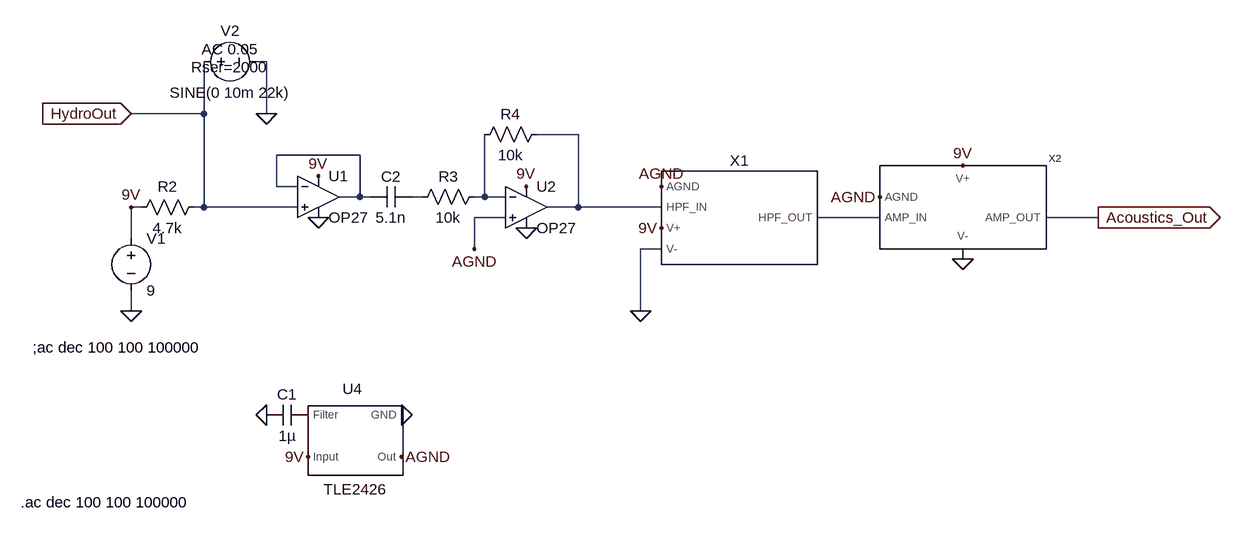
[diagram p0: schematic Combined.asc]
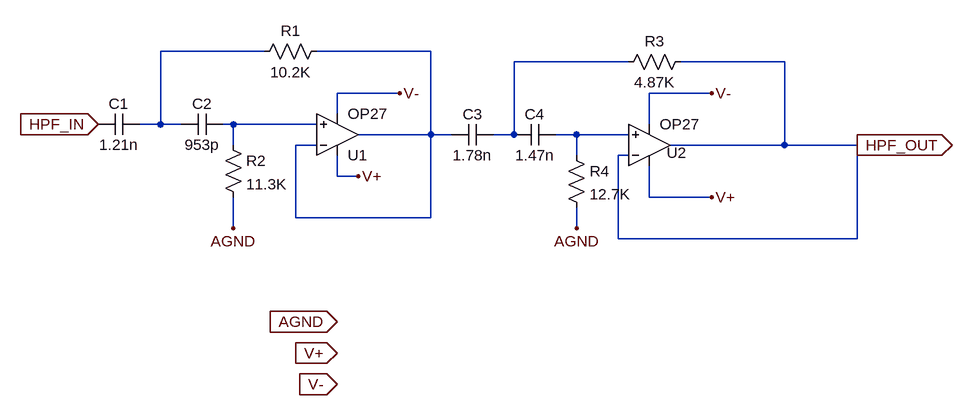
[diagram p1: sub-circuit acoustics_hpf.asc]
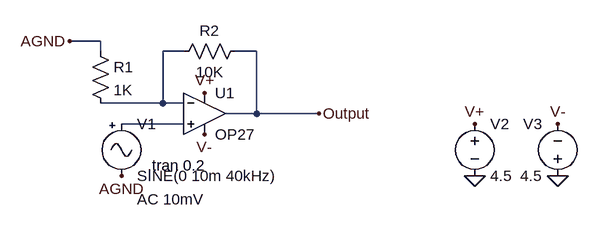
[diagram p2: sub-circuit ampcircuit.asc]
Combined.asc, the LTspice schematic file:
Version 4
SHEET 1 2088 680
WIRE -336 -464 -352 -464
WIRE -432 -384 -432 -464
WIRE -432 -384 -544 -384
WIRE -336 -384 -336 -464
WIRE 144 -352 80 -352
WIRE -192 -320 -320 -320
WIRE -320 -272 -320 -320
WIRE -288 -272 -320 -272
WIRE -192 -256 -192 -320
WIRE -192 -256 -224 -256
WIRE -176 -256 -192 -256
WIRE -96 -256 -112 -256
WIRE 0 -256 0 -352
WIRE 0 -256 -16 -256
WIRE 32 -256 0 -256
WIRE -528 -240 -544 -240
WIRE -432 -240 -432 -384
WIRE -432 -240 -448 -240
WIRE -288 -240 -432 -240
WIRE 144 -240 144 -352
WIRE 144 -240 96 -240
WIRE 272 -240 144 -240
WIRE 32 -224 -16 -224
WIRE 608 -224 512 -224
WIRE 944 -224 864 -224
WIRE -544 -192 -544 -240
WIRE -16 -176 -16 -224
WIRE 272 -176 240 -176
WIRE 736 -160 736 -176
WIRE -544 -80 -544 -112
WIRE 240 -80 240 -176
FLAG -544 -80 0
FLAG -544 -240 9V
FLAG -544 -384 HydroOut
IOPIN -544 -384 In
FLAG -336 -384 0
FLAG -256 -224 0
FLAG 64 -208 0
FLAG -256 -288 9V
FLAG 64 -272 9V
FLAG 272 -272 AGND
FLAG 272 -208 9V
FLAG 240 -80 0
FLAG -16 -176 AGND
FLAG -272 144 9V
FLAG -128 80 0
FLAG -128 144 AGND
FLAG -336 80 0
FLAG 736 -304 9V
FLAG 608 -256 AGND
FLAG 736 -160 0
FLAG 944 -224 Acoustics_Out
IOPIN 944 -224 Out
SYMBOL voltage -544 -208 R0
WINDOW 123 0 0 Left 0
WINDOW 39 0 0 Left 0
SYMATTR InstName V1
SYMATTR Value 9
SYMBOL res -432 -256 R90
WINDOW 0 0 56 VBottom 2
WINDOW 3 32 56 VTop 2
SYMATTR InstName R2
SYMATTR Value 4.7k
SYMATTR SpiceLine tol=1 pwr=0.1
SYMBOL Opamps\\OP27 -256 -320 R0
SYMATTR InstName U1
SYMBOL cap -112 -272 R90
WINDOW 0 0 32 VBottom 2
WINDOW 3 32 32 VTop 2
SYMATTR InstName C2
SYMATTR Value 5.1n
SYMATTR SpiceLine V=50 Irms=0 Rser=0 Lser=0 mfg="Murata" pn="GCM1885C1H512JA16" type="C0G"
SYMBOL res 0 -272 R90
WINDOW 0 0 56 VBottom 2
WINDOW 3 32 56 VTop 2
SYMATTR InstName R3
SYMATTR Value 10k
SYMATTR SpiceLine tol=1 pwr=0.1
SYMBOL Opamps\\OP27 64 -304 R0
SYMATTR InstName U2
SYMBOL res 96 -368 R90
WINDOW 0 0 56 VBottom 2
WINDOW 3 32 56 VTop 2
SYMATTR InstName R4
SYMATTR Value 10k
SYMATTR SpiceLine tol=1 pwr=0.1
SYMBOL voltage -448 -464 R270
WINDOW 0 32 56 VTop 2
WINDOW 3 -32 56 VBottom 2
WINDOW 123 4 56 VTop 2
WINDOW 39 -24 56 VTop 2
SYMATTR InstName V2
SYMATTR Value SINE(0 10m 22k)
SYMATTR Value2 AC 0.05
SYMATTR SpiceLine Rser=2000
SYMBOL Acoustics_HPF 384 -224 R0
SYMATTR InstName X1
SYMBOL TLE2426 -176 128 R0
SYMATTR InstName U4
SYMBOL cap -272 64 R90
WINDOW 0 0 32 VBottom 2
WINDOW 3 32 32 VTop 2
SYMATTR InstName C1
SYMATTR Value 1µ
SYMBOL AmpCircuit 736 -240 R0
SYMATTR InstName X2
TEXT -696 -24 Left 2 !;ac dec 100 100 100000
TEXT -714 214 Left 2 !.ac dec 100 100 100000

acoustics_hpf.asc, the sub-circuit schematic file:
Version 4
SHEET 1 1304 788
WIRE 224 -32 64 -32
WIRE 480 -32 304 -32
WIRE 784 -16 608 -16
WIRE 1024 -16 864 -16
WIRE 432 32 336 32
WIRE 912 32 816 32
WIRE 336 64 336 32
WIRE 64 80 64 -32
WIRE 64 80 32 80
WIRE 96 80 64 80
WIRE 176 80 160 80
WIRE 304 80 176 80
WIRE 816 80 816 32
WIRE 480 96 480 -32
WIRE 480 96 368 96
WIRE 512 96 480 96
WIRE 608 96 608 -16
WIRE 608 96 576 96
WIRE 704 96 672 96
WIRE 784 96 704 96
WIRE 176 112 176 80
WIRE 304 112 272 112
WIRE 1024 112 1024 -16
WIRE 1024 112 848 112
WIRE 1136 112 1024 112
WIRE 704 128 704 96
WIRE 784 128 768 128
WIRE 336 160 336 128
WIRE 368 160 336 160
WIRE 816 192 816 144
WIRE 912 192 816 192
WIRE 272 224 272 112
WIRE 480 224 480 96
WIRE 480 224 272 224
WIRE 176 240 176 192
WIRE 704 240 704 208
WIRE 768 256 768 128
WIRE 1136 256 1136 112
WIRE 1136 256 768 256
FLAG 1136 112 HPF_OUT
IOPIN 1136 112 Out
FLAG 912 192 V+
FLAG 704 240 AGND
FLAG 176 240 AGND
FLAG 368 160 V+
FLAG 912 32 V-
FLAG 432 32 V-
FLAG -32 80 HPF_IN
IOPIN -32 80 In
FLAG 336 384 AGND
IOPIN 336 384 In
FLAG 336 432 V+
IOPIN 336 432 In
FLAG 336 480 V-
IOPIN 336 480 In
SYMBOL cap 32 64 R90
WINDOW 0 0 32 VBottom 2
WINDOW 3 32 32 VTop 2
SYMATTR InstName C1
SYMATTR Value 1.21n
SYMATTR SpiceLine V=6.3 Irms=30.8m Rser=3.04503 Lser=0 mfg="KEMET" pn="C0402C122K9RAC" type="X7R"
SYMBOL cap 96 96 R270
WINDOW 0 32 32 VTop 2
WINDOW 3 0 32 VBottom 2
SYMATTR InstName C2
SYMATTR Value 953p
SYMATTR SpiceLine V=25 Irms=0 Rser=0 Lser=0
SYMBOL res 320 -48 R90
WINDOW 0 0 56 VBottom 2
WINDOW 3 32 56 VTop 2
SYMATTR InstName R1
SYMATTR Value 10.2K
SYMATTR SpiceLine tol=1 pwr=0.1
SYMBOL Opamps\\OP27 336 160 M180
SYMATTR InstName U1
SYMBOL res 160 96 R0
SYMATTR InstName R2
SYMATTR Value 11.3K
SYMATTR SpiceLine tol=1 pwr=0.1
SYMBOL cap 576 80 R90
WINDOW 0 0 32 VBottom 2
WINDOW 3 32 32 VTop 2
SYMATTR InstName C3
SYMATTR Value 1.78n
SYMATTR SpiceLine V=6.3 Irms=46m Rser=2.21949 Lser=0
SYMBOL cap 672 80 R90
WINDOW 0 0 32 VBottom 2
WINDOW 3 32 32 VTop 2
SYMATTR InstName C4
SYMATTR Value 1.47n
SYMATTR SpiceLine V=6.3 Irms=38.4m Rser=2.57238 Lser=0
SYMBOL Opamps\\OP27 816 176 M180
WINDOW 0 27 52 Left 2
SYMATTR InstName U2
SYMBOL res 880 -32 R90
WINDOW 0 0 56 VBottom 2
WINDOW 3 32 56 VTop 2
SYMATTR InstName R3
SYMATTR Value 4.87K
SYMATTR SpiceLine tol=1 pwr=0.1
SYMBOL res 688 112 R0
SYMATTR InstName R4
SYMATTR Value 12.7K
SYMATTR SpiceLine tol=1 pwr=0.1

ampcircuit.asc, the sub-circuit schematic file:
Version 4
SHEET 1 880 680
WIRE 96 32 48 32
WIRE 96 48 96 32
WIRE 224 48 192 48
WIRE 336 48 304 48
WIRE 192 128 192 48
WIRE 192 128 96 128
WIRE 224 128 192 128
WIRE 336 144 336 48
WIRE 336 144 288 144
WIRE 432 144 336 144
WIRE 224 160 128 160
FLAG 256 112 V+
FLAG 256 176 V-
FLAG 432 144 Output
FLAG 672 240 0
FLAG 800 240 0
FLAG 672 160 V+
FLAG 800 160 V-
FLAG 128 240 AGND
FLAG 48 32 AGND
SYMBOL res 80 32 R0
SYMATTR InstName R1
SYMATTR Value 1K
SYMATTR SpiceLine tol=1 pwr=0.1
SYMBOL res 320 32 R90
WINDOW 0 0 56 VBottom 2
WINDOW 3 32 56 VTop 2
SYMATTR InstName R2
SYMATTR Value 10K
SYMATTR SpiceLine tol=1 pwr=0.1
SYMBOL Opamps\\OP27 256 80 R0
SYMATTR InstName U1
SYMBOL Misc\\signal 128 144 R0
WINDOW 123 24 132 Left 2
WINDOW 39 0 0 Left 0
SYMATTR InstName V1
SYMATTR Value SINE(0 10m 40kHz)
SYMATTR Value2 AC 10mV
SYMBOL voltage 672 144 R0
WINDOW 123 0 0 Left 0
WINDOW 39 0 0 Left 0
SYMATTR InstName V2
SYMATTR Value 4.5
SYMBOL voltage 800 256 R180
WINDOW 0 24 96 Left 2
WINDOW 3 24 16 Left 2
WINDOW 123 0 0 Left 0
WINDOW 39 0 0 Left 0
SYMATTR InstName V3
SYMATTR Value 4.5
TEXT 168 224 Left 2 !.tran 0.2

The netlist it stands for:
* Combined.asc
V1 9V 0 9
R2 HydroOut 9V 4.7k tol=1 pwr=0.1
XU1 HydroOut N002 9V 0 N002 OP27  ; pins In+ In- V+ V- OUT
C2 N003 N002 5.1n V=50 Irms=0 Rser=0 Lser=0 mfg="Murata" pn="GCM1885C1H512JA16" type="C0G"
R3 N004 N003 10k tol=1 pwr=0.1
XU2 AGND N004 9V 0 N001 OP27  ; pins In+ In- V+ V- OUT
R4 N001 N004 10k tol=1 pwr=0.1
V2 HydroOut 0 SINE(0 10m 22k) AC 0.05 Rser=2000
XX1 AGND N001 9V 0 N005 acoustics_hpf
XU4 P001 9V 0 AGND TLE2426  ; pins Filter Input GND Out
C1 P001 0 1µ
XX2 AGND 0 9V N005 Acoustics_Out ampcircuit

* block symbol definitions
.subckt acoustics_hpf AGND HPF_IN V+ V- HPF_OUT
C1 N001 HPF_IN 1.21n V=6.3 Irms=30.8m Rser=3.04503 Lser=0 mfg="KEMET" pn="C0402C122K9RAC" type="X7R"
C2 N001 N004 953p V=25 Irms=0 Rser=0 Lser=0
R1 N002 N001 10.2K tol=1 pwr=0.1
XU1 N004 N002 V+ V- N002 OP27  ; pins In+ In- V+ V- OUT
R2 N004 AGND 11.3K tol=1 pwr=0.1
C3 N003 N002 1.78n V=6.3 Irms=46m Rser=2.21949 Lser=0
C4 N005 N003 1.47n V=6.3 Irms=38.4m Rser=2.57238 Lser=0
XU2 N005 HPF_OUT V+ V- HPF_OUT OP27  ; pins In+ In- V+ V- OUT
R3 HPF_OUT N003 4.87K tol=1 pwr=0.1
R4 N005 AGND 12.7K tol=1 pwr=0.1
.ends acoustics_hpf

.subckt ampcircuit AGND V- V+ AMP_IN AMP_OUT
R1 AGND N001 1K tol=1 pwr=0.1
R2 Output N001 10K tol=1 pwr=0.1
XU1 N002 N001 V+ V- Output OP27  ; pins In+ In- V+ V- OUT
V1 N002 AGND SINE(0 10m 40kHz) AC 10mV
V2 V+ 0 4.5
V3 0 V- 4.5
.tran 0.2
.ends ampcircuit

;ac dec 100 100 100000
.ac dec 100 100 100000
.lib ADI.lib
.lib TLE2426.5_1
.backanno
.end